# Altium schematic sheet extBoard_sheet4_adc.SchDoc: EXT BOARD - A/D Converter
size A4; Revision: 0.1.0; SheetNumber: 4; SheetTotal: 5; Author: NALO; DrawnBy: NALO; DocumentSize: A4; PCAName: EXT BOARD; ProjectName: Bachelor's Thesis
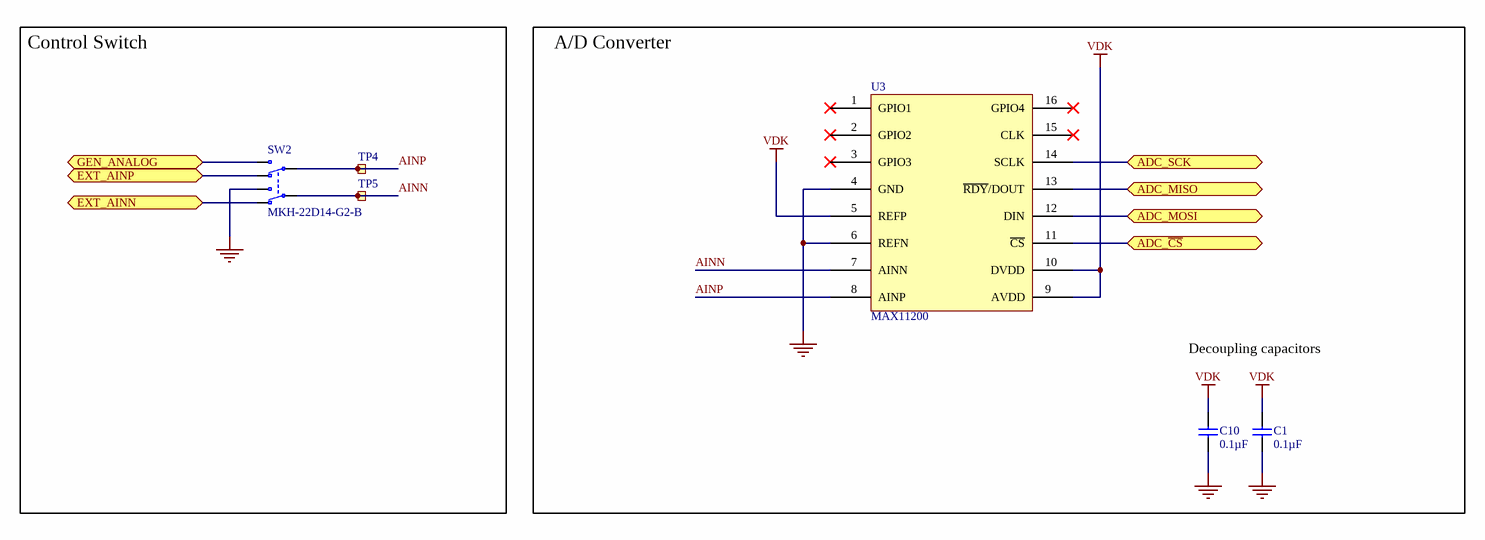
[diagram p0: extBoard_sheet4_adc.SchDoc]

## Parts
C1  0.1µF  [CAPC2012X11L]
C10  0.1µF  [CAPC2012X11L]
SW2  MKH-22D14-G2-B  [MKH-22D14-G2-B]
TP4  TP  [TESTPAD-TH]  (value not drawn)  (no BOM)
TP5  TP  [TESTPAD-TH]  (value not drawn)  (no BOM)
U3  MAX11200  [QSOP16]

## Blocks framed on the sheet
Control Switch: SW2 TP4 TP5
A/D Converter: C1 C10 U3

## Ports
ADC_MISO (bidir), ADC_MOSI (bidir), ADC_SCK (bidir), ADC_~{CS} (bidir), EXT_AINN (bidir), EXT_AINP (bidir), GEN_ANALOG (bidir)

## Nets
GND: C1.1 C10.1 SW2.1(N.O-1) U3.4(GND) U3.6(REFN)
VDK: C1.2 C10.2 U3.5(REFP) U3.9(AVDD) U3.10(DVDD)
ADC_~{CS}: U3.11(~{CS}) ; port ADC_~{CS}
ADC_MISO: U3.13(~{RDY}/DOUT) ; port ADC_MISO
ADC_MOSI: U3.12(DIN) ; port ADC_MOSI
ADC_SCK: U3.14(SCLK) ; port ADC_SCK
AINN: SW2.2(COM-1) TP5.1 U3.7(AINN)
AINP: SW2.5(COM-2) TP4.1 U3.8(AINP)
EXT_AINN: SW2.3(N.C-1) ; port EXT_AINN
EXT_AINP: SW2.6(N.C-2) ; port EXT_AINP
GEN_ANALOG: SW2.4(N.O-2) ; port GEN_ANALOG

Not connected (* = marked no-connect by the designer): U3 1(GPIO1)* 2(GPIO2)* 3(GPIO3)* 15(CLK)* 16(GPIO4)*

## Notes on the sheet
- Decoupling capacitors
- Title
- Size
- Date:
- Project Number
- Sheet         of
- Revision
- File:
- Drawn By:

## Library data of the parts
C1 C10 = CAP_0805: Capacitor, X5R, ±10%; Part Number: C0805-4µ7; Note: 16V; Artikkelnr Noca: 20039266; Artikkelnr Simpro: N.A.; Manufacturer: *; Manufacturer Part Number: *; Datasheet: *; Footprint Doc: 0805; LatestRevisionDate: 2013-06-04; Pin Count: 2; Publisher: Nordic Semiconductor; Published: 2009-08-21; Value: 0.1µF; Supplier: *; Supplier part number: *; 2nd source Supplier: *; 2nd source part number: *
SW2 = MKH-22D14-G2-B: Slide Switch DPDT; Manufacturer: Dailywell; Artikkelnr Noca: 50019112; Artikkelnr Simpro: N.A.; Part Number: MKH-22D14-G2-B; Manufacturer Part Number: MKH-22D14-G2-B; Datasheet: \\hizz\pro\app9717\Datasheet\switches\Dailywell\MKH-22D14-G2-B.pdf; Footprint Doc: MKH-22D14-G2-B; LatestRevisionDate: 2016-08-18; Pin Count: 6; Publisher: Nordic Semiconductor; Published: 2016-08-18; Value: MKH-22D14-G2-B; Note: *; Supplier: *; Supplier part number: *; 2nd source Supplier: *; 2nd source part number: *
TP4 TP5 = Testpoint TH: Testpoint, through hole; Artikkelnr Noca: N.A.; Part Number: Testpoint TH; Manufacturer: *; Manufacturer Part Number: *; Datasheet: *; Footprint Doc: TESTPAD-TH; LatestRevisionDate: 2009-12-12; Pin Count: 1; Publisher: Nordic Semiconductor; Published: 2009-12-12; Value: TP; Note: *; Supplier: *; Supplier part number: *; 2nd source Supplier: *; 2nd source part number: *; Artikkelnr Simpro: N.A.